# EAGLE schematic beer-pong (EAGLE 9.5.1)
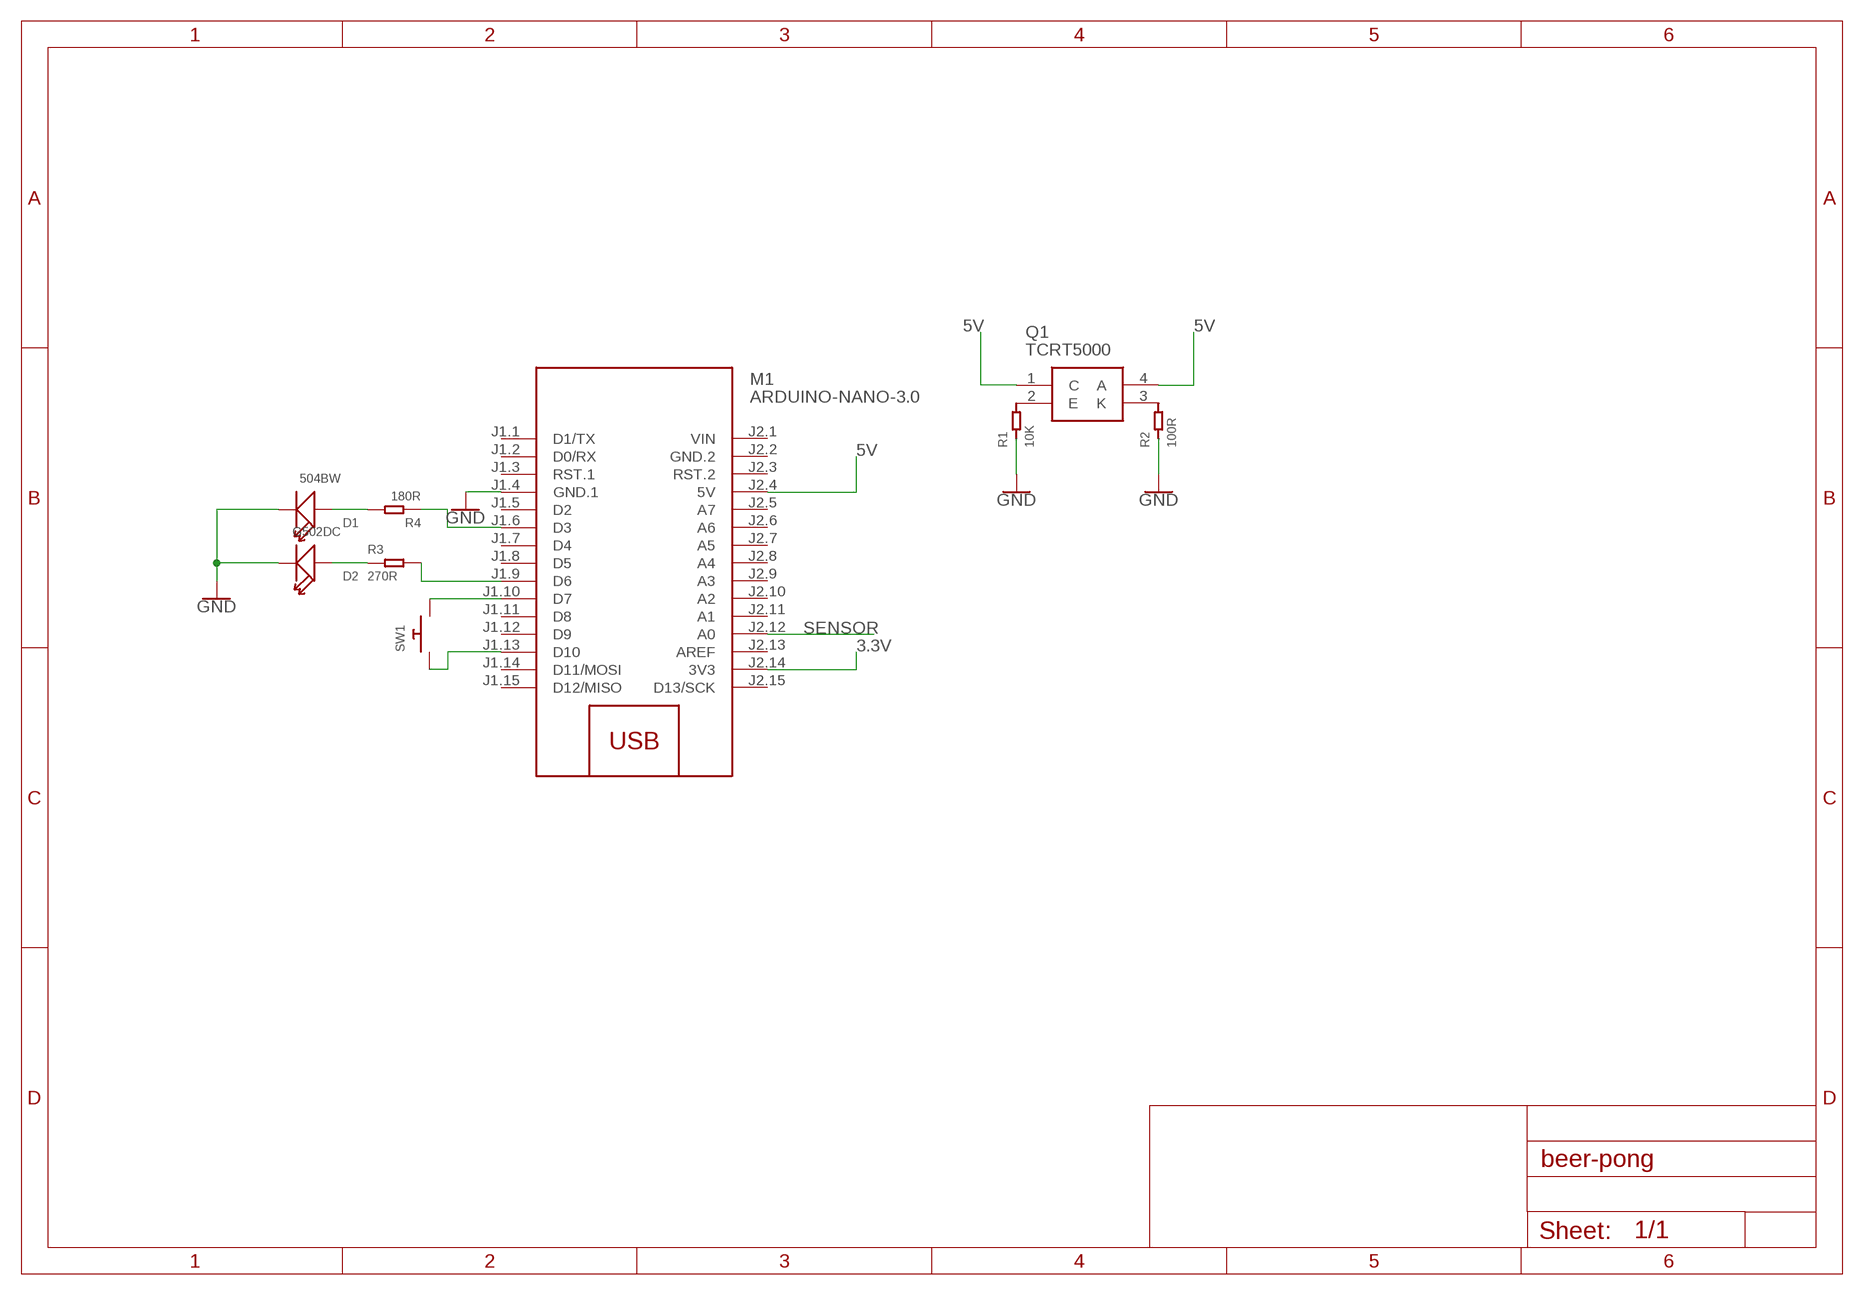
[diagram p0: schematic, sheet 1]

## Parts
D1  504BW  DIP-LED-BLUE-BLUE(2P-D5MM)  [LED2-2.54-D5.0MM]
D2  G502DC  DIP-LED-GREEN-GREEN(2P-D5MM)  [LED2-2.54-D5.0MM]
M1  ARDUINO-NANO-3.0  [ARDUINO-NANO-3.0]
Q1  TCRT5000  [TCRT5000]
R1  10K  DIP-RES-10K-5%-1/4W(PR-D2.3XL6.5MM)  [PR-D2.3XL6.5MM]
R2  100R  DIP-RES-100R-5%-1/4W(PR-D2.3XL6.5MM)  [PR-D2.3XL6.5MM]
R3  270R  DIP-RES-220R-5%-1/4W(PR-D2.3XL6.5MM)  [PR-D2.3XL6.5MM]
R4  180R  DIP-RES-220R-5%-1/4W(PR-D2.3XL6.5MM)  [PR-D2.3XL6.5MM]
SW1  SWITCH_PUSHBUTTONEVQ-PE  [TACT_PANA-EVQ]

## Nets
3.3V: M1.J2.14(3V3)
5V: M1.J2.4(5V) Q1.1(C) Q1.4(A)
GND: D1.- D2.- M1.J1.4(GND.1) R1.1 R2.1
N$1: Q1.2(E) R1.2
N$2: Q1.3(K) R2.2
N$3: D2.+ R3.1
N$4: D1.+ R4.2
N$5: M1.J1.6(D3) R4.1
N$6: M1.J1.9(D6) R3.2
N$7: M1.J1.13(D10) SW1.P$1
N$8: M1.J1.10(D7) SW1.P$2
SENSOR: M1.J2.12(A0)
Unconnected: M1.J1.1(D1/TX) M1.J1.2(D0/RX) M1.J1.3(RST.1) M1.J1.5(D2) M1.J1.7(D4) M1.J1.8(D5) M1.J1.11(D8) M1.J1.12(D9) M1.J1.14(D11/MOSI) M1.J1.15(D12/MISO) M1.J2.3(RST.2) M1.J2.5(A7) M1.J2.6(A6) M1.J2.7(A5) M1.J2.8(A4) M1.J2.9(A3) M1.J2.10(A2) M1.J2.11(A1) M1.J2.13(AREF) M1.J2.15(D13/SCK)

## Power pins joined to a net without a drawn wire
GND.2: M1.J2.2(GND.2)
VIN: M1.J2.1(VIN)

## Library data of the parts
D1 = OPL_Optoelectronics:DIP-LED-BLUE-BLUE(2P-D5MM): 304090062; MPN: 504BW
D2 = OPL_Optoelectronics:DIP-LED-GREEN-GREEN(2P-D5MM): 304090038; MPN: G502DC
M1 = diy-modules:ARDUINO-NANO-3.0: Arduino Nano 3.0 and compatible devices More details available here: https://www.arduino.cc/en/Main/ArduinoBoardNano Click here to find device on ebay.com <http://www.ebay.com/sch/arduino+nano>
Q1 = SamacSys_Parts:TCRT5000: VISHAY - TCRT5000. - SENSOR, OPTICAL, TRANSISTOR O/P Source: Datasheet <http://www.vishay.com/docs/83760/tcrt5000.pdf>; ALLIED_NUMBER: R1084611; ALLIED_PRICE-STOCK: http://www.alliedelec.com/vishay-dale-tcrt5000/R1084611/; DESCRIPTION: VISHAY - TCRT5000. - SENSOR, OPTICAL, TRANSISTOR O/P; HEIGHT: 6.8mm; MANUFACTURER_NAME: Vishay; MANUFACTURER_PART_NUMBER: TCRT5000; MOUSER_PART_NUMBER: 782-TCRT5000; MOUSER_PRICE-STOCK: https://www.mouser.com/Search/Refine.aspx?Keyword=782-TCRT5000; RS_PART_NUMBER: 7085017P; RS_PRICE-STOCK: http://uk.rs-online.com/web/p/products/7085017P
R1 = Seeed-Resistor:DIP-RES-10K-5%-1/4W(PR-D2.3XL6.5MM): 301020001; MPN: FHCFR-1/4W-103J
R2 = Seeed-Resistor:DIP-RES-100R-5%-1/4W(PR-D2.3XL6.5MM): 301020017; MPN: FHCFR-1/4W-101J
R3 R4 = OPL_Resistor:DIP-RES-220R-5%-1/4W(PR-D2.3XL6.5MM): 301020011; MPN: FHCFR-1/4W-221J; VALUE: 220R
SW1 = adafruit:SWITCH_PUSHBUTTON: Buttons SOFTTOUCHSMD_SJ - Soft touch temporary push button (Super Junk Akihabara) Compatible with SKPMANE010 [Mouser: 688-SKPMAN] C&K_KSS = Digikey: KSS221GLFS